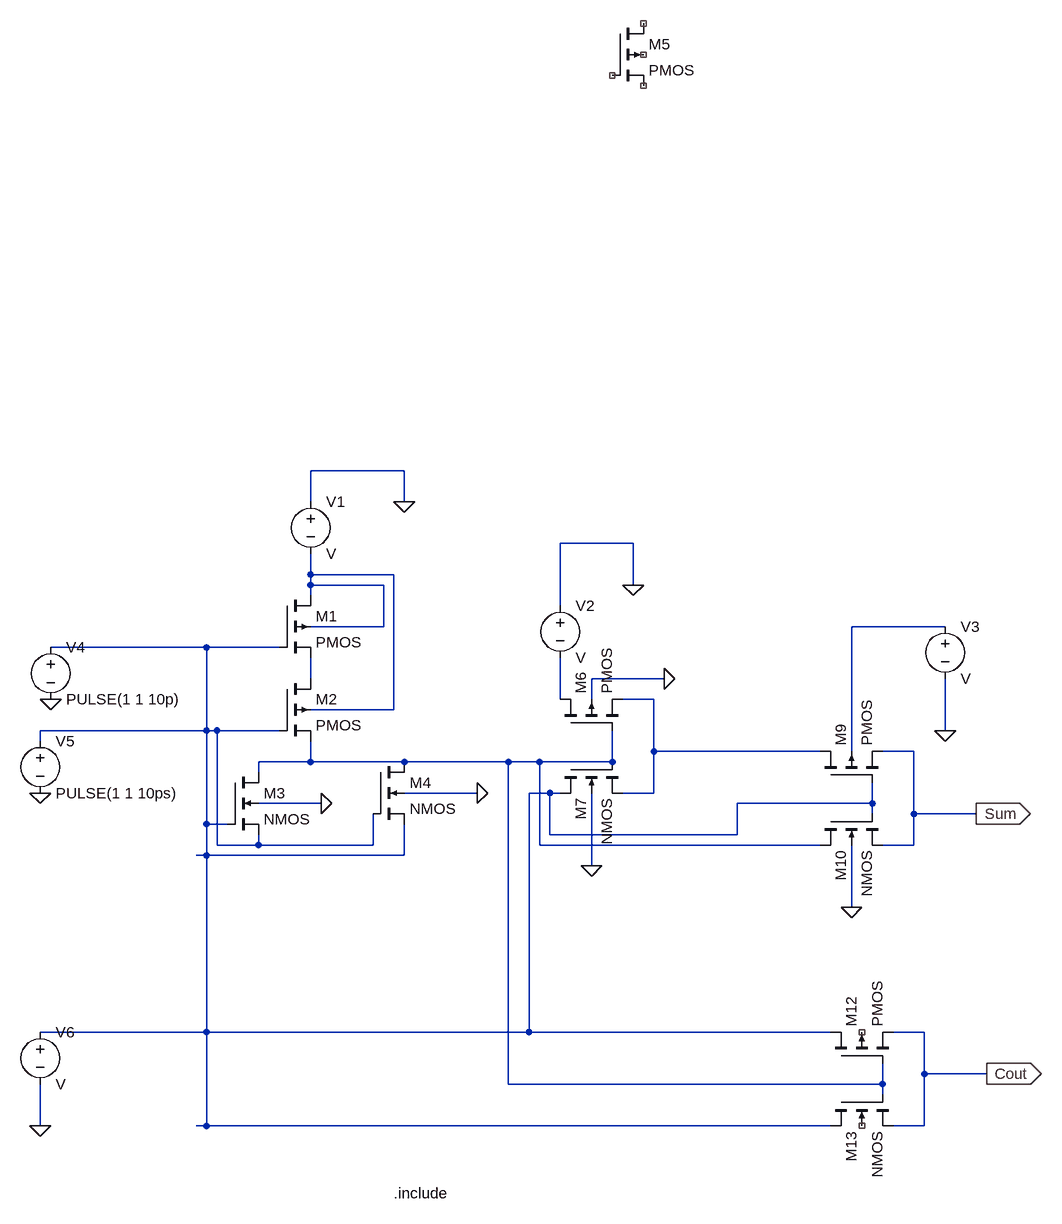
[diagram p0: schematic 31oct.asc]
31oct.asc, the LTspice schematic file:
Version 4
SHEET 1 1440 1032
WIRE 432 -96 288 -96
WIRE 288 -48 288 -96
WIRE 432 -48 432 -96
WIRE 784 16 672 16
WIRE 288 64 288 32
WIRE 416 64 288 64
WIRE 288 80 288 64
WIRE 400 80 288 80
WIRE 784 80 784 16
WIRE 288 96 288 80
WIRE 672 112 672 16
WIRE 400 144 400 80
WIRE 400 144 288 144
WIRE 1264 144 1120 144
WIRE 128 176 -112 176
WIRE 240 176 128 176
WIRE 288 224 288 192
WIRE 832 224 720 224
WIRE 672 256 672 192
WIRE 720 256 720 224
WIRE 816 256 768 256
WIRE 416 272 416 64
WIRE 416 272 288 272
WIRE 128 304 128 176
WIRE 128 304 -128 304
WIRE 144 304 128 304
WIRE 240 304 144 304
WIRE 1264 304 1264 224
WIRE -128 320 -128 304
WIRE 816 336 816 256
WIRE 1072 336 816 336
WIRE 1120 336 1120 144
WIRE 1216 336 1168 336
WIRE 288 352 288 320
WIRE 288 352 208 352
WIRE 432 352 288 352
WIRE 592 352 432 352
WIRE 640 352 592 352
WIRE 752 352 752 304
WIRE 752 352 640 352
WIRE 208 368 208 352
WIRE 544 400 432 400
WIRE 656 400 624 400
WIRE 672 400 656 400
WIRE 816 400 816 336
WIRE 816 400 768 400
WIRE 304 416 208 416
WIRE 1152 416 1152 384
WIRE 1152 416 944 416
WIRE 1152 432 1152 416
WIRE 1216 432 1216 336
WIRE 1312 432 1216 432
WIRE 128 448 128 304
WIRE 160 448 128 448
WIRE 656 464 656 400
WIRE 944 464 944 416
WIRE 944 464 656 464
WIRE 144 480 144 304
WIRE 208 480 208 464
WIRE 208 480 144 480
WIRE 384 480 384 432
WIRE 384 480 208 480
WIRE 640 480 640 352
WIRE 1072 480 640 480
WIRE 1216 480 1216 432
WIRE 1216 480 1168 480
WIRE 128 496 128 448
WIRE 128 496 112 496
WIRE 432 496 432 448
WIRE 432 496 128 496
WIRE 720 512 720 400
WIRE 1120 576 1120 480
WIRE 128 768 128 496
WIRE 128 768 -128 768
WIRE 624 768 624 400
WIRE 624 768 128 768
WIRE 1088 768 624 768
WIRE 1232 768 1184 768
WIRE 1232 832 1232 768
WIRE 1328 832 1232 832
WIRE 592 848 592 352
WIRE 1168 848 1168 816
WIRE 1168 848 592 848
WIRE 1168 864 1168 848
WIRE -128 912 -128 848
WIRE 128 912 128 768
WIRE 128 912 112 912
WIRE 1088 912 128 912
WIRE 1232 912 1232 832
WIRE 1232 912 1184 912
FLAG 432 -48 0
FLAG 784 80 0
FLAG 1264 304 0
FLAG 1120 576 0
FLAG 720 512 0
FLAG 832 224 0
FLAG 544 400 0
FLAG 304 416 0
FLAG 1312 432 Sum
IOPIN 1312 432 Out
FLAG 1328 832 Cout
IOPIN 1328 832 Out
FLAG -128 912 0
FLAG -128 400 0
FLAG -112 256 0
SYMBOL nmos4 160 368 R0
SYMATTR InstName M3
SYMATTR Value2 l=45n w=90n
SYMBOL nmos4 384 352 R0
SYMATTR InstName M4
SYMATTR Value2 l=45n w=90n
SYMBOL pmos4 240 96 R0
SYMATTR InstName M1
SYMATTR Value2 l=45n w=180n
SYMBOL pmos4 240 224 R0
SYMATTR InstName M2
SYMATTR Value2 l=45n w=180n
SYMBOL pmos4 752 -784 R0
SYMATTR InstName M5
SYMBOL pmos4 672 304 R270
SYMATTR InstName M6
SYMATTR Value2 l=45n w=180n
SYMBOL nmos4 672 352 M90
SYMATTR InstName M7
SYMATTR Value2 l=45n w=90n
SYMBOL pmos4 1072 384 R270
SYMATTR InstName M9
SYMATTR Value2 l=45n w=180n
SYMBOL nmos4 1072 432 M90
SYMATTR InstName M10
SYMATTR Value2 l=45n w=90n
SYMBOL pmos4 1088 816 R270
SYMATTR InstName M12
SYMATTR Value2 l=45n w=180n
SYMBOL nmos4 1088 864 M90
SYMATTR InstName M13
SYMATTR Value2 l=45n w=90n
SYMBOL voltage 288 -64 R0
SYMATTR InstName V1
SYMBOL voltage 672 96 R0
SYMATTR InstName V2
SYMBOL voltage 1264 128 R0
SYMATTR InstName V3
SYMBOL voltage -112 160 R0
WINDOW 123 0 0 Left 0
WINDOW 39 0 0 Left 0
SYMATTR InstName V4
SYMATTR Value PULSE(1 1 10p)
SYMBOL voltage -128 304 R0
WINDOW 123 0 0 Left 0
WINDOW 39 0 0 Left 0
SYMATTR InstName V5
SYMATTR Value PULSE(1 1 10ps)
SYMBOL voltage -128 752 R0
SYMATTR InstName V6
TEXT 416 1016 Left 2 !.include

The netlist it stands for:
* 31oct.asc
M3 N007 N003 N003 0 NMOS l=45n w=90n
M4 N007 N003 N003 0 NMOS l=45n w=90n
M1 N001 N003 N004 N001 PMOS l=45n w=180n
M2 N004 N003 N007 N001 PMOS l=45n w=180n
M5 NC_01 NC_02 NC_03 NC_04 PMOS
M6 N005 N007 N006 0 PMOS l=45n w=180n
M7 N003 N007 N006 0 NMOS l=45n w=90n
M9 N006 N003 Sum N002 PMOS l=45n w=180n
M10 N007 N003 Sum 0 NMOS l=45n w=90n
M12 N003 N007 Cout NC_05 PMOS l=45n w=180n
M13 N003 N007 Cout NC_06 NMOS l=45n w=90n
V1 0 N001 V
V2 0 N005 V
V3 N002 0 V
V4 N003 0 PULSE(1 1 10p)
V5 N003 0 PULSE(1 1 10ps)
V6 N003 0 V
.model NMOS NMOS
.model PMOS PMOS
.lib standard.mos
.include
.backanno
.end